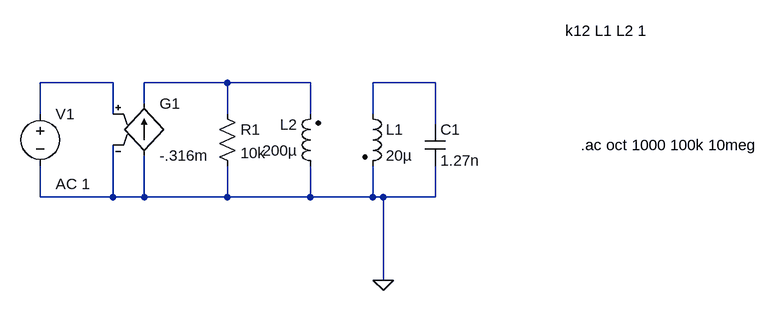
[diagram p0: schematic sintonizado2.asc]
sintonizado2.asc, the LTspice schematic file:
Version 4
SHEET 1 880 680
WIRE -240 80 -352 80
WIRE -64 80 -192 80
WIRE 64 80 -64 80
WIRE 256 80 160 80
WIRE -192 112 -192 80
WIRE -352 128 -352 80
WIRE -240 128 -240 80
WIRE -64 128 -64 80
WIRE 64 128 64 80
WIRE 160 128 160 80
WIRE 256 144 256 80
WIRE -352 256 -352 208
WIRE -240 256 -240 176
WIRE -240 256 -352 256
WIRE -192 256 -192 192
WIRE -192 256 -240 256
WIRE -64 256 -64 208
WIRE -64 256 -192 256
WIRE 64 256 64 208
WIRE 64 256 -64 256
WIRE 160 256 160 208
WIRE 160 256 64 256
WIRE 176 256 160 256
WIRE 256 256 256 208
WIRE 256 256 176 256
WIRE 176 384 176 256
FLAG 176 384 0
SYMBOL ind2 144 112 R0
SYMATTR InstName L1
SYMATTR Value 20µ
SYMBOL ind2 80 224 R180
WINDOW 0 36 80 Left 2
WINDOW 3 36 40 Left 2
SYMATTR InstName L2
SYMATTR Value 200µ
SYMBOL cap 240 144 R0
SYMATTR InstName C1
SYMATTR Value 1.27n
SYMBOL g -192 96 R0
SYMATTR InstName G1
SYMATTR Value -.316m
SYMBOL voltage -352 112 R0
WINDOW 123 24 124 Left 2
WINDOW 39 0 0 Left 2
SYMATTR InstName V1
SYMATTR Value ""
SYMATTR Value2 AC 1
SYMBOL res -80 112 R0
SYMATTR InstName R1
SYMATTR Value 10k
TEXT 456 0 Left 2 !k12 L1 L2 1
TEXT 480 176 Left 2 !.ac oct 1000 100k 10meg

The netlist it stands for:
* sintonizado2.asc
L1 N003 0 20µ
L2 0 N002 200µ
C1 N003 0 1.27n
G1 0 N002 N001 0 -.316m
V1 N001 0 AC 1
R1 N002 0 10k
k12 L1 L2 1
.ac oct 1000 100k 10meg
.backanno
.end